# Altium schematic sheet CSM37F58 V6.1.SchDoc
size A3; PageSetup: Record=PageOptions|CenterHorizontal=True|CenterVertical=True|PrintScale=0.73|XCorrection=1.00|YCorrection=1.00|PrintKind=0|BorderSize=5000000|LeftOffset=0|BottomOffset=0|Orientation=2|PaperLength=1000|PaperWidth=1000|Scale=100|PaperSource=7|PrintQuality=-4|MediaType=1|DitherType=10|PaperKind=A3 (297 x 420 mm)|PrintScaleMode=1
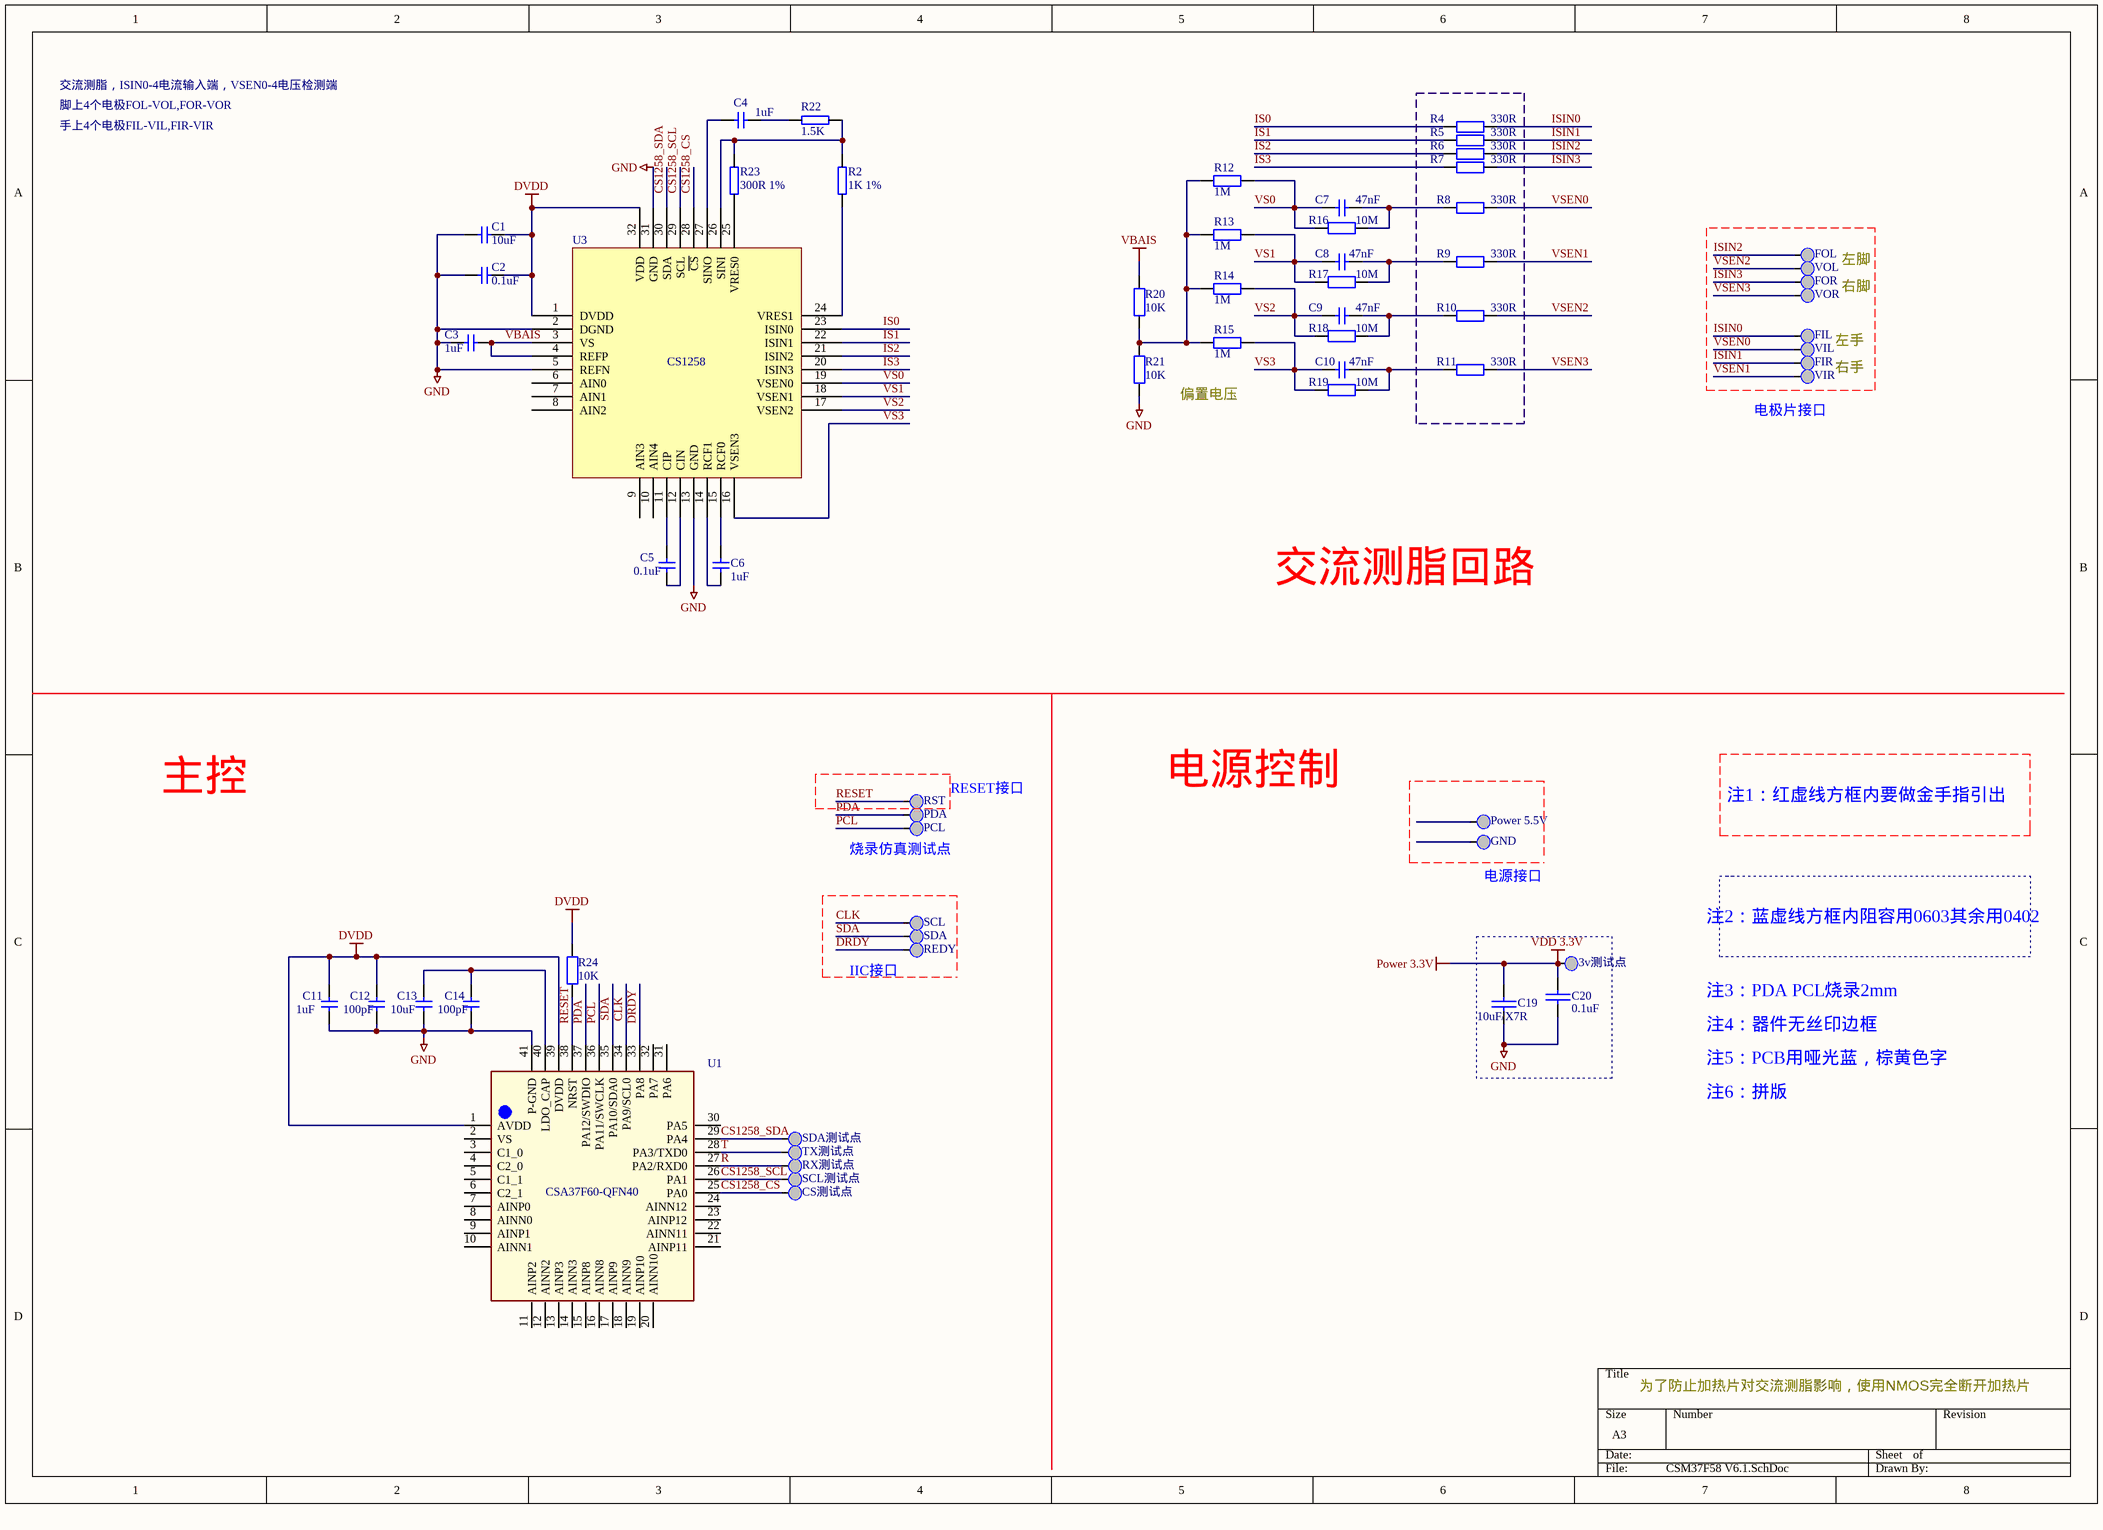
[diagram p0: CSM37F58 V6.1.SchDoc]

## Parts
3v测试点  (no value)  [TEST-SMD]
C1  10uF  [C0603E]
C2  0.1uF  [C0603E]
C3  1uF  [C0603E]
C4  1uF  [C0603E]
C5  0.1uF  [C0603E]
C6  1uF  [C0603E]
C7  47nF  [C0603E]
C8  47nF  [C0603E]
C9  47nF  [C0603E]
C10  47nF  [C0603E]
C11  1uF  [C0603E]
C12  100pF  [C0603E]
C13  10uF  [C0603E]
C14  100pF  [C0603E]
C19  10uF/X7R  [C0603]
C20  0.1uF  [C0603]
CS测试点  (no value)  [TEST-SMD]
FIL  TESTPOINT  [TEST-SMD]  (value not drawn)
FIR  TESTPOINT  [TEST-SMD]  (value not drawn)
FOL  TESTPOINT  [TEST-SMD]  (value not drawn)
FOR  TESTPOINT  [TEST-SMD]  (value not drawn)
GND  (no value)  [TEST-SMD]
PCL  (no value)  [TEST-SMD]
PDA  (no value)  [TEST-SMD]
Power_5.5V  (no value)  [TEST-SMD]
R2  1K 1%  [R0603E]
R4  value 330R  [R0603E]  (hidden comment: Res2)
R5  value 330R  [R0603E]  (hidden comment: Res2)
R6  value 330R  [R0603E]  (hidden comment: Res2)
R7  value 330R  [R0603E]  (hidden comment: Res2)
R8  value 330R  [R0603E]  (hidden comment: Res2)
R9  value 330R  [R0603E]  (hidden comment: Res2)
R10  value 330R  [R0603E]  (hidden comment: Res2)
R11  value 330R  [R0603E]  (hidden comment: Res2)
R12  value 1M  [R0603E]  (hidden comment: Res2)
R13  value 1M  [R0603E]  (hidden comment: Res2)
R14  value 1M  [R0603E]  (hidden comment: Res2)
R15  value 1M  [R0603E]  (hidden comment: Res2)
R16  value 10M  [R0603E]  (hidden comment: Res2)
R17  value 10M  [R0603E]  (hidden comment: Res2)
R18  value 10M  [R0603E]  (hidden comment: Res2)
R19  value 10M  [R0603E]  (hidden comment: Res2)
R20  value 10K  [R0603E]  (hidden comment: Res2)
R21  value 10K  [R0603E]  (hidden comment: Res2)
R22  1.5K  [R0603E]
R23  300R 1%  [R0603E]
R24  value 10K  [R0603E]  (hidden comment: Res2)
REDY  (no value)  [TEST-SMD]
RST  (no value)  [TEST-SMD]
RX测试点  (no value)  [TEST-SMD]
SCL  (no value)  [TEST-SMD]
SCL测试点  (no value)  [TEST-SMD]
SDA  (no value)  [TEST-SMD]
SDA测试点  (no value)  [TEST-SMD]
TX测试点  (no value)  [TEST-SMD]
U1  CSA37F60-QFN40  [QFN40-04]
U3  CS1258  [LQFP32]
VIL  TESTPOINT  [TEST-SMD]  (value not drawn)
VIR  TESTPOINT  [TEST-SMD]  (value not drawn)
VOL  TESTPOINT  [TEST-SMD]  (value not drawn)
VOR  TESTPOINT  [TEST-SMD]  (value not drawn)

## Nets
DVDD: C1.2 C2.1 C11.1 C12.1 R24.2 U1.1(AVDD) U1.39(DVDD) U3.1(DVDD) U3.32(VDD)
GND: C1.1 C2.2 C3.2 C11.2 C12.2 C13.2 C14.2 C19.2 C20.2 R21.1 U1.41(P-GND) U3.2(DGND) U3.5(REFN) U3.13(GND) U3.31(GND)
Power 3.3V: 3v测试点.1 C19.1 C20.1  [also labelled VDD 3.3V]
VBAIS: C3.1 R20.1 U3.3(VS) U3.4(REFP)
CLK: SCL.1 U1.34(PA9/SCL0)
CS1258_CS: CS测试点.1 U1.25(PA0) U3.28(~{CS})
CS1258_SCL: SCL测试点.1 U1.26(PA1) U3.29(SCL)
CS1258_SDA: SDA测试点.1 U1.29(PA4) U3.30(SDA)
DRDY: REDY.1 U1.33(PA8)
IS0: R4.1 U3.23(ISIN0)
IS1: R5.1 U3.22(ISIN1)
IS2: R6.1 U3.21(ISIN2)
IS3: R7.1 U3.20(ISIN3)
ISIN0: FIL.1 R4.2
ISIN1: FIR.1 R5.2
ISIN2: FOL.1 R6.2
ISIN3: FOR.1 R7.2
PCL: PCL.1 U1.36(PA11/SWCLK)
PDA: PDA.1 U1.37(PA12/SWDIO)
R: RX测试点.1 U1.27(PA2/RXD0)
RESET: R24.1 RST.1 U1.38(NRST)
SDA: SDA.1 U1.35(PA10/SDA0)
T: TX测试点.1 U1.28(PA3/TXD0)
VS0: C7.1 R12.1 R16.2 U3.19(VSEN0)
VS1: C8.1 R13.1 R17.2 U3.18(VSEN1)
VS2: C9.1 R14.1 R18.2 U3.17(VSEN2)
VS3: C10.1 R15.1 R19.2 U3.16(VSEN3)
VSEN0: R8.2 VIL.1
VSEN1: R9.2 VIR.1
VSEN2: R10.2 VOL.1
VSEN3: R11.1 VOR.1
NetC4_1: C4.1 R22.2
NetC4_2: C4.2 U3.27(SINO)
NetC5_1: C5.1 U3.11(CIP)
NetC5_2: C5.2 U3.12(CIN)
NetC6_1: C6.1 U3.14(RCF1)
NetC6_2: C6.2 U3.15(RCF0)
NetC7_2: C7.2 R8.1 R16.1
NetC8_2: C8.2 R9.1 R17.1
NetC9_2: C9.2 R10.1 R18.1
NetC10_2: C10.2 R11.2 R19.1
NetC13_1: C13.1 C14.1 U1.40(LDO_CAP)
NetR2_1: R2.1 U3.24(VRES1)
NetR2_2: R2.2 R22.1 R23.1 U3.26(SINI)
NetR12_2: R12.2 R13.2 R14.2 R15.2 R20.2 R21.2
NetR23_2: R23.2 U3.25(VRES0)

Not connected (* = marked no-connect by the designer): GND 1; Power_5.5V 1; U1 2(VS) 3(C1_0) 4(C2_0) 5(C1_1) 6(C2_1) 7(AINP0) 8(AINN0) 9(AINP1) 10(AINN1) 11(AINP2) 12(AINN2) 13(AINP3) 14(AINN3) 15(AINP8) 16(AINN8) 17(AINP9) 18(AINN9) 19(AINP10) 20(AINN10) 21(AINP11) 22(AINN11) 23(AINP12) 24(AINN12) 30(PA5) 31(PA6) 32(PA7); U3 6(AIN0) 7(AIN1) 8(AIN2) 9(AIN3) 10(AIN4)

## Notes on the sheet
- 交流测脂，ISIN0-4电流输入端，VSEN0-4电压检测端
- 脚上4个电极FOL-VOL,FOR-VOR
- 手上4个电极FIL-VIL,FIR-VIR
- 左脚
- 右脚
- 左手
- 右手
- 偏置电压
- 电极片接口
- 交流测脂回路
- RESET接口
- 主控
- (near PCL) 烧录仿真测试点
- 电源控制
- 注1：红虚线方框内要做金手指引出
- (near GND) 电源接口
- 注2：蓝虚线方框内阻容用0603其余用0402
- IIC接口
- 注3：PDA PCL烧录2mm
- 注4：器件无丝印边框
- 注5：PCB用哑光蓝，棕黄色字
- 注6：拼版
- 为了防止加热片对交流测脂影响，使用NMOS完全断开加热片

## Library data of the parts
3v测试点 CS测试点 GND PCL PDA Power_5.5V REDY RST RX测试点 SCL SCL测试点 SDA SDA测试点 TX测试点 = TESTPOINT
C1-C14 = CAP: Text Field1: 0.1; 0.1: *
C19 C20 = CAP: Capacitor
R2 R22 R23 = RES
R4-R21 R24 = Res2: Resistor; Published: 8-Jun-2000; LatestRevisionDate: 17-Jul-2002; LatestRevisionNote: Re-released for DXP Platform.; PackageReference: AXIAL-0.4; Publisher: Altium Limited
U1 = CSA37F60-QFN40: PCB DECAL: QFN40-04